# Altium schematic sheet 大直-絕境擴散.SchDoc
size A3
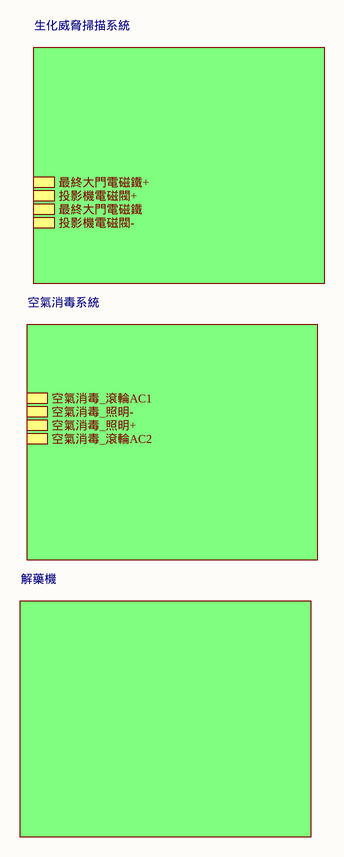
[diagram p0: 大直-絕境擴散.SchDoc]

## Sub-sheets
生化威脅掃描系統 = 大直-絕境擴散-生化威脅掃描系統.SchDoc: 最終大門電磁鐵+, 投影機電磁閥+, 最終大門電磁鐵, 投影機電磁閥-
空氣消毒系統 = 大直-絕境擴散-空氣消毒系統.SchDoc: 空氣消毒_滾輪AC1, 空氣消毒_照明-, 空氣消毒_照明+, 空氣消毒_滾輪AC2
解藥機 = 大直-絕境擴散-解藥機.SchDoc: no entries